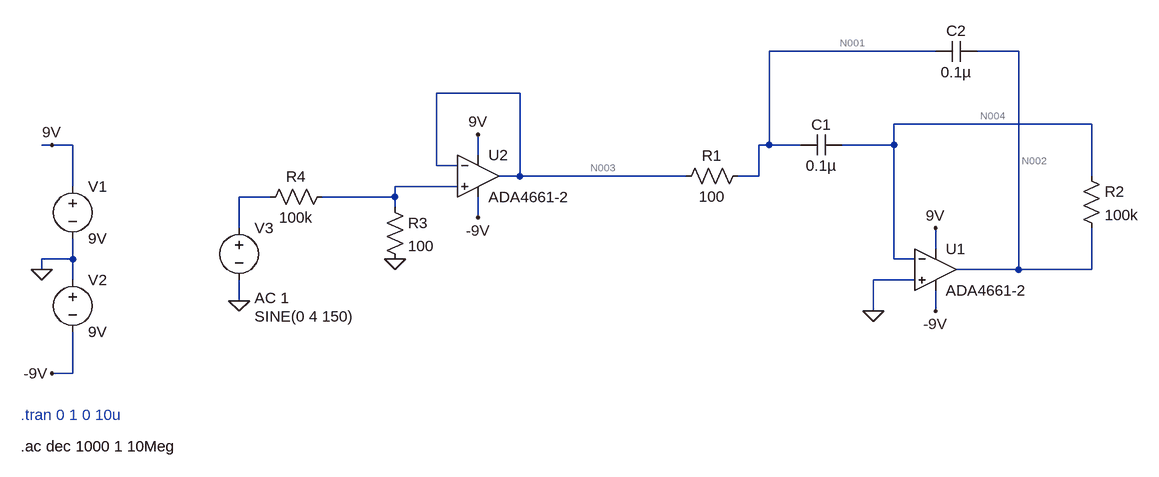
[diagram p0: schematic bp filter.asc]
bp filter.asc, the LTspice schematic file:
Version 4
SHEET 1 960 680
WIRE 640 -288 384 -288
WIRE 768 -288 704 -288
WIRE 0 -224 -128 -224
WIRE 880 -176 576 -176
WIRE -720 -144 -736 -144
WIRE -688 -144 -720 -144
WIRE 384 -144 384 -288
WIRE 384 -144 368 -144
WIRE 432 -144 384 -144
WIRE 576 -144 576 -176
WIRE 576 -144 496 -144
WIRE -64 -128 -64 -160
WIRE -128 -112 -128 -224
WIRE -96 -112 -128 -112
WIRE 0 -96 0 -224
WIRE 0 -96 -32 -96
WIRE 256 -96 0 -96
WIRE 368 -96 368 -144
WIRE 368 -96 336 -96
WIRE 880 -96 880 -176
WIRE -688 -80 -688 -144
WIRE -96 -80 -192 -80
WIRE -384 -64 -432 -64
WIRE -192 -64 -192 -80
WIRE -192 -64 -304 -64
WIRE -192 -48 -192 -64
WIRE -64 -32 -64 -64
WIRE -432 -16 -432 -64
WIRE 640 16 640 -16
WIRE -688 32 -688 0
WIRE -688 32 -736 32
WIRE 576 32 576 -144
WIRE 608 32 576 32
WIRE -736 48 -736 32
WIRE 768 48 768 -288
WIRE 768 48 672 48
WIRE 880 48 880 -16
WIRE 880 48 768 48
WIRE -688 64 -688 32
WIRE 608 64 544 64
WIRE -432 96 -432 64
WIRE 544 112 544 64
WIRE 640 112 640 80
WIRE -688 208 -688 144
WIRE -688 208 -720 208
FLAG -736 48 0
FLAG -720 -144 9V
FLAG -720 208 -9V
FLAG 640 -16 9V
FLAG 640 112 -9V
FLAG -432 96 0
FLAG -64 -160 9V
FLAG -64 -32 -9V
FLAG -192 32 0
FLAG 544 112 0
SYMBOL voltage -688 -96 R0
WINDOW 123 0 0 Left 0
WINDOW 39 0 0 Left 0
SYMATTR InstName V1
SYMATTR Value 9V
SYMBOL voltage -688 48 R0
WINDOW 123 0 0 Left 0
WINDOW 39 0 0 Left 0
SYMATTR InstName V2
SYMATTR Value 9V
SYMBOL voltage -432 -32 R0
WINDOW 3 24 152 Left 2
WINDOW 123 24 124 Left 2
WINDOW 39 0 0 Left 0
SYMATTR InstName V3
SYMATTR Value SINE(0 4 150)
SYMATTR Value2 AC 1
SYMBOL OpAmps\\ADA4661-2 640 -16 R0
SYMATTR InstName U1
SYMBOL res 864 -112 R0
SYMATTR InstName R2
SYMATTR Value 100k
SYMBOL cap 496 -160 R90
WINDOW 0 0 32 VBottom 2
WINDOW 3 32 32 VTop 2
SYMATTR InstName C1
SYMATTR Value 0.1µ
SYMATTR SpiceLine V=25 Irms=2.1 Rser=0.0606238 Lser=0 mfg="KEMET" pn="C1210C104K3RAC" type="X7R"
SYMBOL res 352 -112 R90
WINDOW 0 0 56 VBottom 2
WINDOW 3 32 56 VTop 2
SYMATTR InstName R1
SYMATTR Value 100
SYMBOL cap 704 -304 R90
WINDOW 0 0 32 VBottom 2
WINDOW 3 32 32 VTop 2
SYMATTR InstName C2
SYMATTR Value 0.1µ
SYMATTR SpiceLine V=25 Irms=0 Rser=0.037 Lser=674p mfg="Würth Elektronik" pn="885012210008 WCAP-CSGP 1812" type="X7R"
SYMBOL OpAmps\\ADA4661-2 -64 -160 R0
SYMATTR InstName U2
SYMBOL res -208 -64 R0
SYMATTR InstName R3
SYMATTR Value 100
SYMBOL res -288 -80 R90
WINDOW 0 0 56 VBottom 2
WINDOW 3 32 56 VTop 2
SYMATTR InstName R4
SYMATTR Value 100k
TEXT -768 272 Left 2 ;.tran 0 1 0 10u
TEXT -768 320 Left 2 !.ac dec 1000 1 10Meg

The netlist it stands for:
* bp filter.asc
V1 9V 0 9V
V2 0 -9V 9V
V3 N006 0 SINE(0 4 150) AC 1
XU1 0 N004 9V -9V N002 ADA4661-2  ; pins In+ In- V+ V- OUT
R2 N004 N002 100k
C1 N004 N001 0.1µ V=25 Irms=2.1 Rser=0.0606238 Lser=0 mfg="KEMET" pn="C1210C104K3RAC" type="X7R"
R1 N001 N003 100
C2 N002 N001 0.1µ V=25 Irms=0 Rser=0.037 Lser=674p mfg="Würth Elektronik" pn="885012210008 WCAP-CSGP 1812" type="X7R"
XU2 N005 N003 9V -9V N003 ADA4661-2  ; pins In+ In- V+ V- OUT
R3 N005 0 100
R4 N005 N006 100k
* .tran 0 1 0 10u
.ac dec 1000 1 10Meg
.lib ADI1.lib
.backanno
.end

* Results of the author's LTspice run, read from the files saved beside the schematic
* Operating Point, zero values left out:
*   V(9v) = 9 V
*   V(-9v) = -9 V
*   V(n004) = 497.5 µV
*   V(n002) = 497.3 µV
*   V(n001) = 497.5 µV
*   V(n003) = 497.5 µV
*   I(R2) = 1.5 pA
*   I(R3) = -1.499 pA
*   I(V1) = -2.517 mA
*   I(V2) = -2.517 mA
*   Ix(u1:1) = 1.5 pA
*   Ix(u1:2) = -1.5 pA
*   Ix(u1:99) = 1.259 mA
*   Ix(u1:50) = -1.259 mA
*   Ix(u1:45) = 1.5 pA
*   Ix(u2:1) = 1.5 pA
*   Ix(u2:2) = -1.5 pA
*   Ix(u2:99) = 1.259 mA
*   Ix(u2:50) = -1.259 mA
*   Ix(u2:45) = 1.5 pA
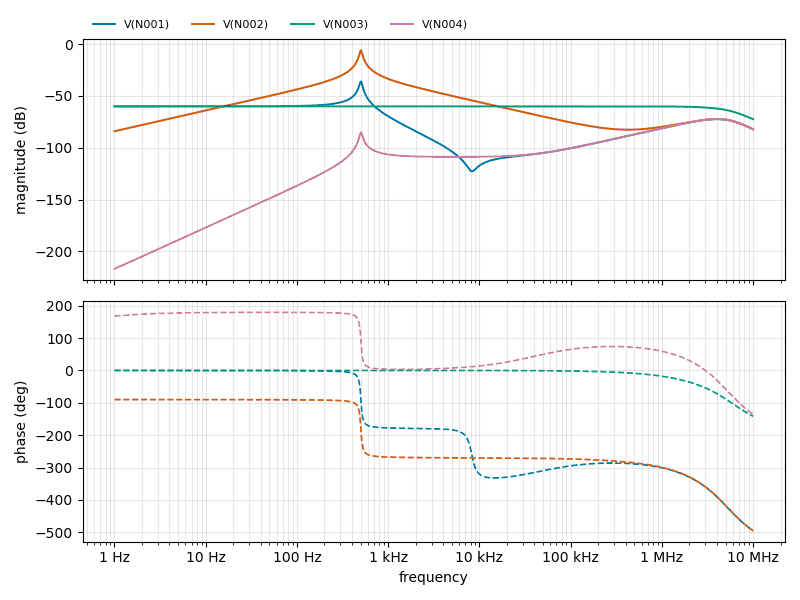
[diagram p1: AC Analysis of bp filter.asc, plotted from the saved traces]
* AC Analysis, 1 run:
*   V(N001): -60.01 dB at 1 Hz, -82.11 dB at 10 MHz, peak -36.04 dB at 502.3 Hz, 3 dB below the peak at 485.8 Hz and 517.5 Hz
*   V(N002): -84.05 dB at 1 Hz, -82.12 dB at 10 MHz, peak -6.02 dB at 502.3 Hz, 3 dB below the peak at 486.8 Hz and 518.5 Hz
*   V(N003): -60.01 dB at 1 Hz, -72.47 dB at 10 MHz, peak -60.00 dB at 501.2 Hz, 3 dB below the peak at 4.7 MHz
*   V(N004): -216.77 dB at 1 Hz, -82.11 dB at 10 MHz, peak -72.32 dB at 4.027 MHz, 3 dB below the peak at 2.065 MHz and 6.587 MHz